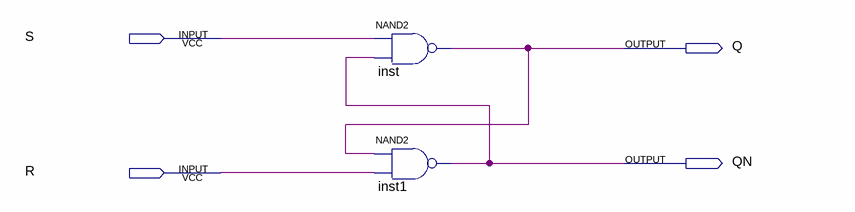
[diagram p0: schematic sheet]
// Quartus schematic sr_ff_and.bdf as structural Verilog: 2 symbols, 4 pins
module sr_ff_and (
  input  S,
  input  R,
  output Q,
  output QN
);

  nand inst (Q, S, QN);
  nand inst1 (QN, Q, R);
endmodule
